# EAGLE design LM2621 (EAGLE 9.5.2)
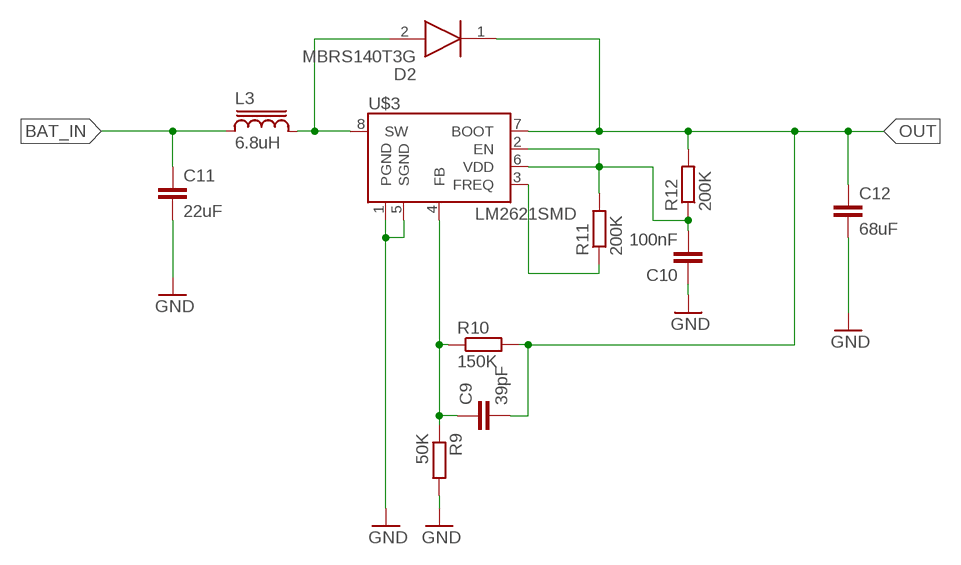
[diagram p0: schematic, sheet 1]

## Parts
C9  39pF  C-EUC0805  [C0805]
C10  100nF  C-EUC0805  [C0805]
C11  22uF  C-EUC1210  [C1210]
C12  68uF  C-EUC1210  [C1210]
D2  MBRS140T3G  [DIOM5436X247N]
L3  6.8uH  SRR1280  [SRR1280]
R9  50K  R-EU_R0805  [R0805]
R10  150K  R-EU_R0805  [R0805]
R11  200K  R-EU_R0805  [R0805]
R12  200K  R-EU_R0805  [R0805]
U$3  LM2621SMD  [MSOP-8]

## Nets
BAT_IN: C11.1 L3.1
GND: C10.1 C11.2 C12.2 R9.2 U$3.1(PGND) U$3.5(SGND)
N$9: C9.1 R9.1 R10.1 U$3.4(FB)
N$10: D2.2(A) L3.2 U$3.8(SW)
N$11: C10.2 R11.2 R12.1 U$3.2(EN) U$3.6(VDD)
N$12: R11.1 U$3.3(FREQ)
OUT: C9.2 C12.1 D2.1(K) R10.2 R12.2 U$3.7(BOOT)

## Library data of the parts
C9-C12 = rcl:C-EU: CAPACITOR, European symbol; SPICEPREFIX: C
D2 = MBRS140T3G:MBRS140T3G: Source: Datasheet <http://www.onsemi.com/pub/Collateral/MBRS140T3-D.PDF>; ALLIED_NUMBER: 70099505; ALLIED_PRICE/STOCK: http://www.alliedelec.com/on-semiconductor-mbrs140t3g/70099505/; ARROW_PART_NUMBER: MBRS140T3G; ARROW_PRICE/STOCK: https://www.arrow.com/en/products/mbrs140t3g/on-semiconductor; HEIGHT: 2.47mm; MANUFACTURER_NAME: ON Semiconductor; MANUFACTURER_PART_NUMBER: MBRS140T3G; RS_PART_NUMBER: 5452074P; RS_PRICE/STOCK: http://uk.rs-online.com/web/p/products/5452074P
L3 = inductor-bourns:SRR1280: POWER INDUCTOR
R9-R12 = rcl:R-EU_: RESISTOR, European symbol; SPICEPREFIX: R
U$3 = SparkFun-PowerIC:LM2621: Step-up switching regulator IC

## Board
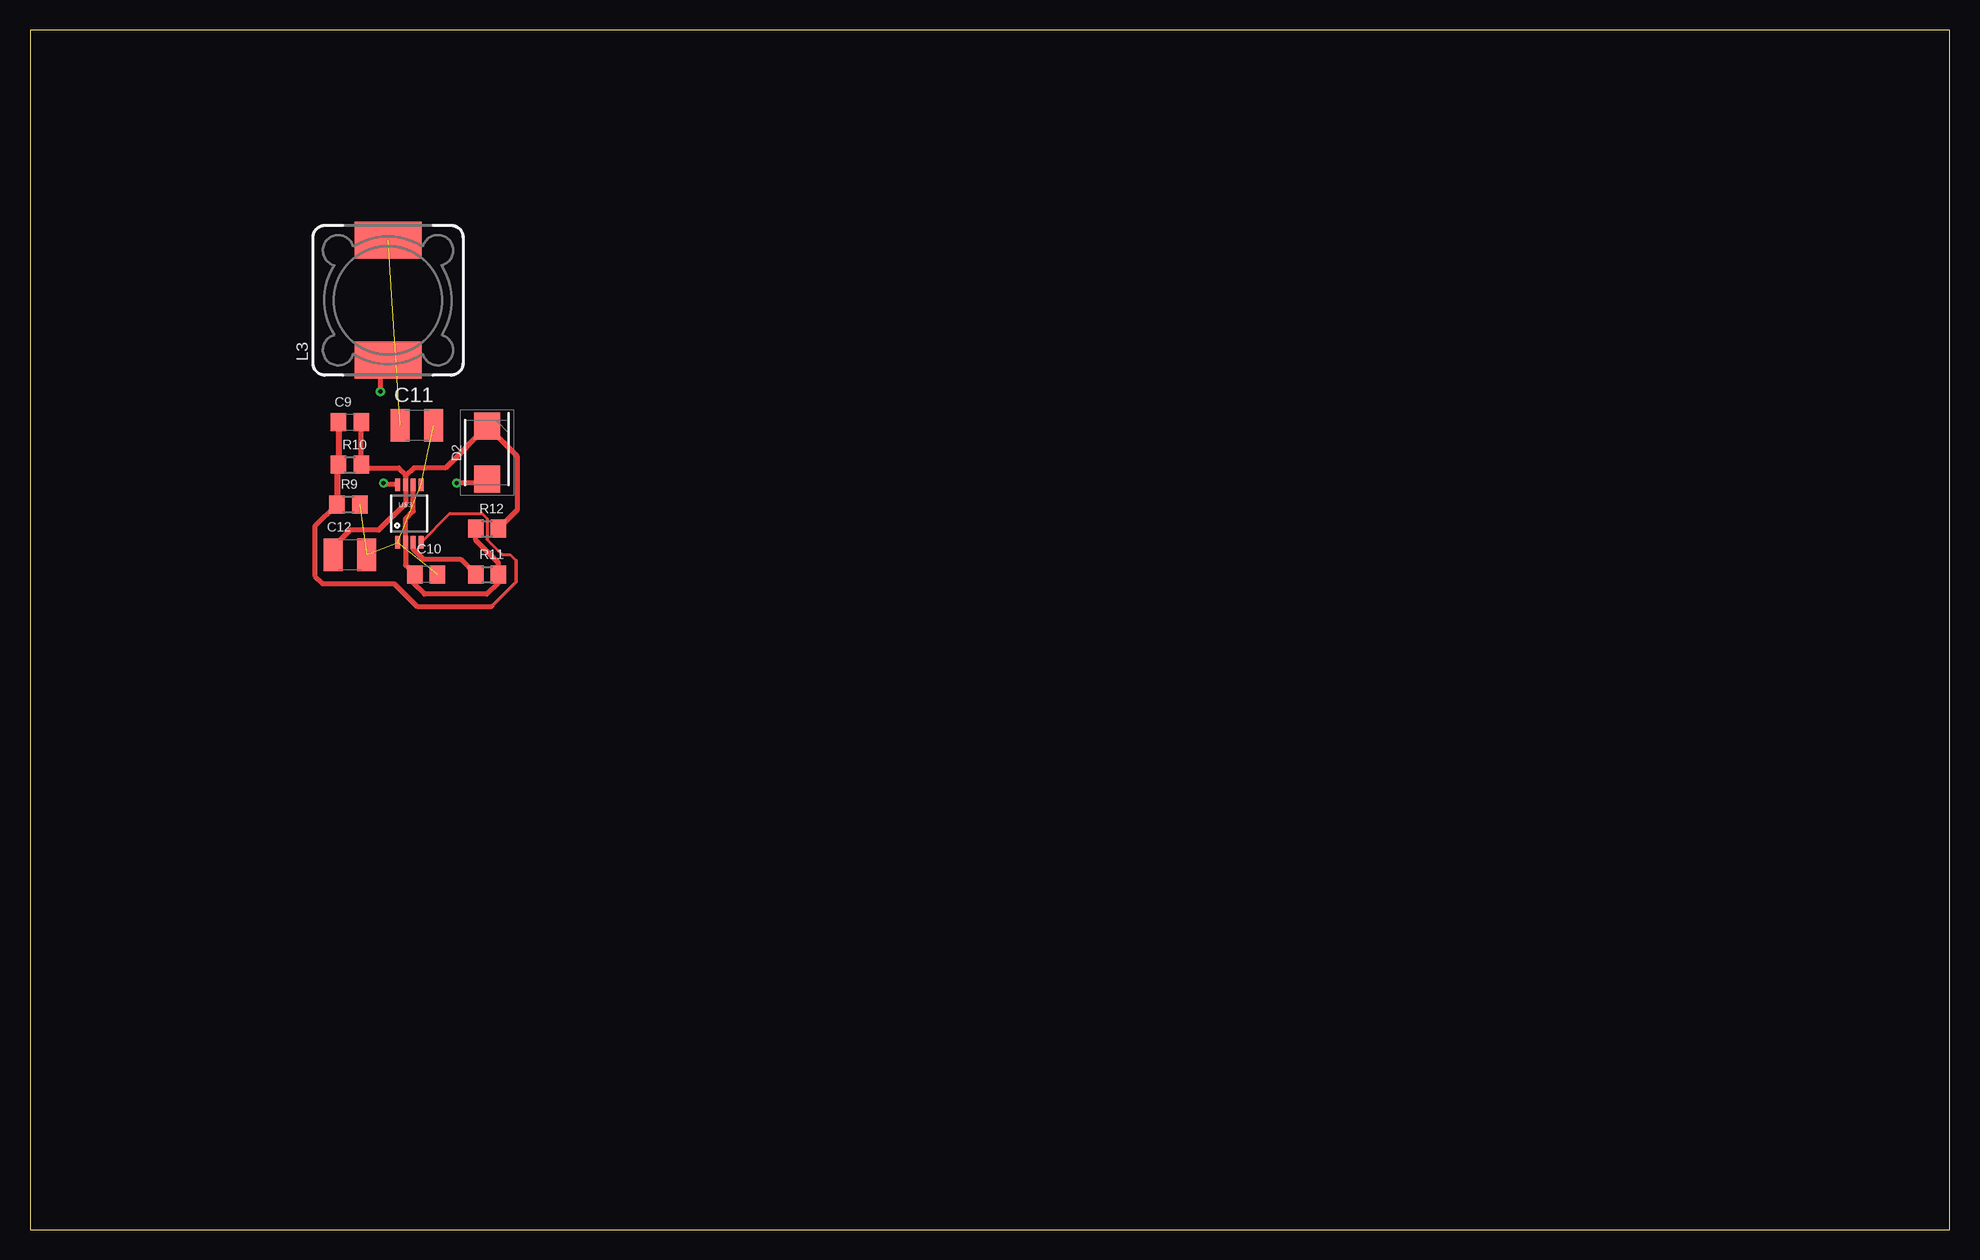
[diagram p1: board, top side]
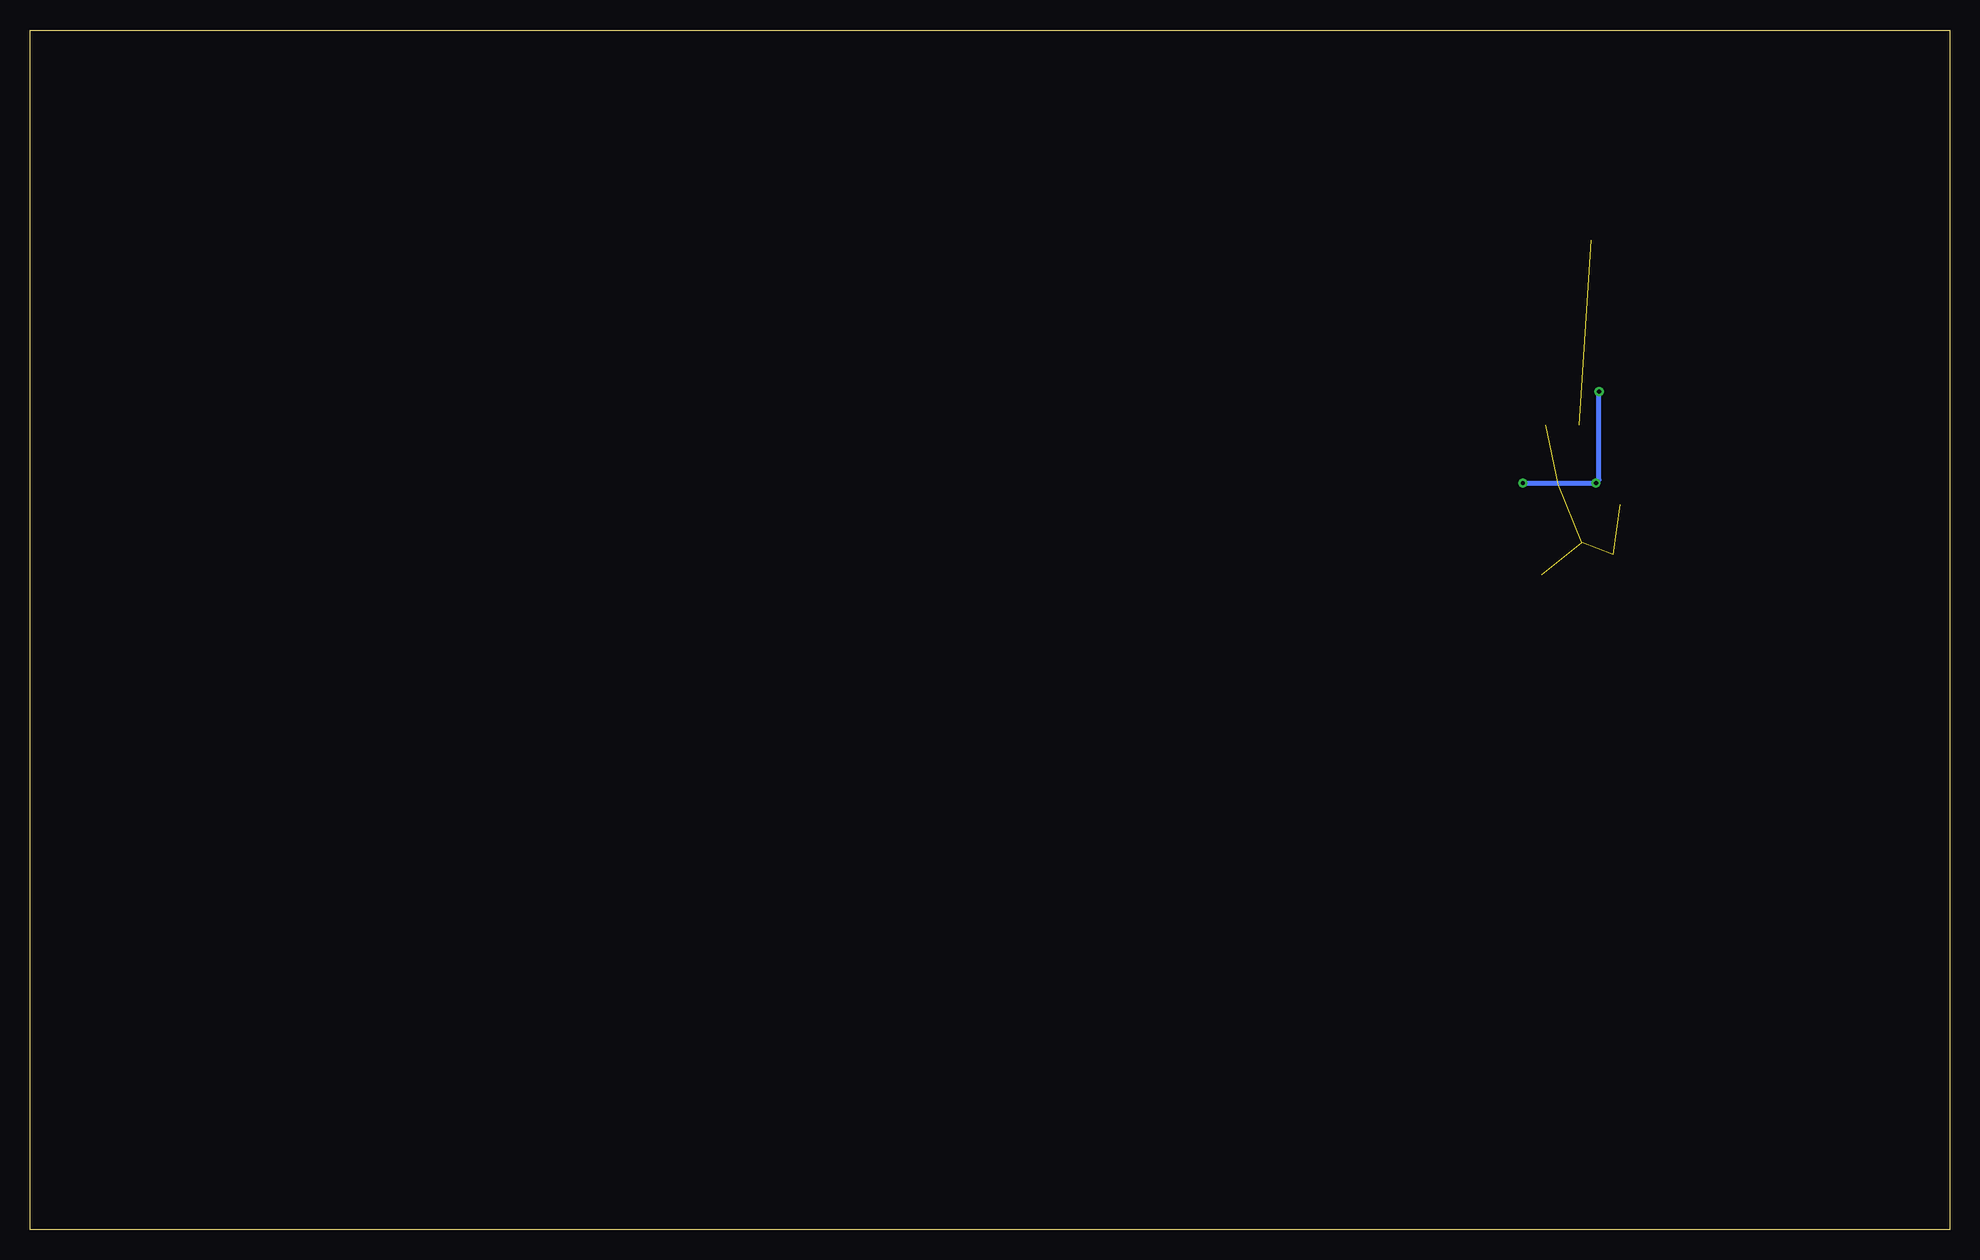
[diagram p2: board, bottom side, seen from below]

Size 160 x 100 mm. Coordinates in mm from the lower left corner, seen from the top.
Outline: 0,0 160,0 160,100 0,100 0,0
Copper layers (1*16): Top 0.035mm / dielectric 1.5mm / Bottom 0.035mm
Design rules "default": minimum track width 6mil, minimum drill 0.35mm, track to track 6mil, track to pad 6mil, pad to pad 6mil, via to via 6mil, smd to smd 6mil, copper to edge 40mil, drill to drill 6mil, minimum pad ring 10mil, minimum via ring 8mil, stop-mask expansion 4mil, vias tented up to drill 0mil, thermal gap 10mil

### Footprints (pad centres in the part's own frame; a part is rotated, then mirrored left to right if it is on the bottom)
C0805 = smd 1.3 x 1.5: 1 -0.95,0; 2 0.95,0
C1210 = smd 1.6 x 2.7: 1 -1.4,0; 2 1.4,0
DIOM5436X247N = smd 2.25 x 2.15: 1 -2.2,0; 2 2.2,0
SRR1280 = smd 5.6 x 3.1: 1 0.635,5; 2 0.635,-5
R0805 = smd 1.3 x 1.5: 1 -0.95,0; 2 0.95,0
MSOP-8 = smd 0.41 x 1.02: 1 -0.975,-2.4; 2 -0.325,-2.4; 3 0.325,-2.4; 4 0.975,-2.4; 5 0.975,2.4; 6 0.325,2.4; 7 -0.325,2.4; 8 -0.975,2.4

### Placement (x,y rotation side)
C9  26.67,67.31 0 top
C10  33.02,54.61 180 top
C11  32.26,67.06 0 top
C12  26.67,56.26 0 top
D2  38.1,64.77 270 top
L3  29.21,77.47 0 top
R9  26.54,60.45 0 top
R10  26.67,63.75 0 top
R11  38.1,54.61 0 top
R12  38.1,58.42 0 top
U$3  31.62,59.69 0 top

### Tracks (layer width: path | path; a pad name or v marks a point on that pad's centre or on a via)
BAT_IN  (1 unrouted)
GND  (5 unrouted)
N$9
  Top 0.254: 40.51,55.75 40.01,56.26 39.37,56.26 38.1,57.53 38.1,59.27 37.67,59.69 35,59.69 U$3.4
  Top 0.305: 38.48,51.94 40.51,53.98 40.51,55.75
  Top 0.406: R9.1 23.75,58.61 23.75,54.48 24.38,53.85 30.35,53.85 32.26,51.94 38.48,51.94
  Top 0.508: C9.1 R10.1 25.59,63.63 R9.1
N$10  (via drill 0.35)
  Top 0.406: U$3.8 29.6,62.09 v29.46,62.23 | v29.21,69.85 29.21,71.83 L3.2 | D2.2 37.76,62.23 v35.56,62.23
  Bottom 0.406: v29.21,69.85 29.21,62.48 29.34,62.36 v29.46,62.23 v35.56,62.23
N$11
  Top 0.406: U$3.6 31.95,59.89 31.3,59.24 U$3.2 31.3,55.38 31.91,54.77 | 37.15,57.79 R12.1 37.15,57.47 39.05,55.56 R11.2 39.05,53.91 38.1,52.96 32.89,52.96 31.91,53.94 31.91,54.77 | 31.91,54.77 C10.2
N$12
  Top 0.406: U$3.3 31.91,57.25 31.91,56.76 32.79,55.88 35.88,55.88 R11.1
OUT
  Top 0.406: C9.2 R10.2 27.87,63.5 30.73,63.5 31.3,62.94 31.3,62.79 | 31.3,62.79 U$3.7 31.3,60.51 29.08,58.29 26.67,58.29 25.27,56.89 C12.1 | R12.2 40.64,60.01 40.64,64.43 D2.1 34.63,63.5 32,63.5 31.3,62.79